# EAGLE design 16 ch sample-and-hold card v3 (EAGLE 9.6.2)
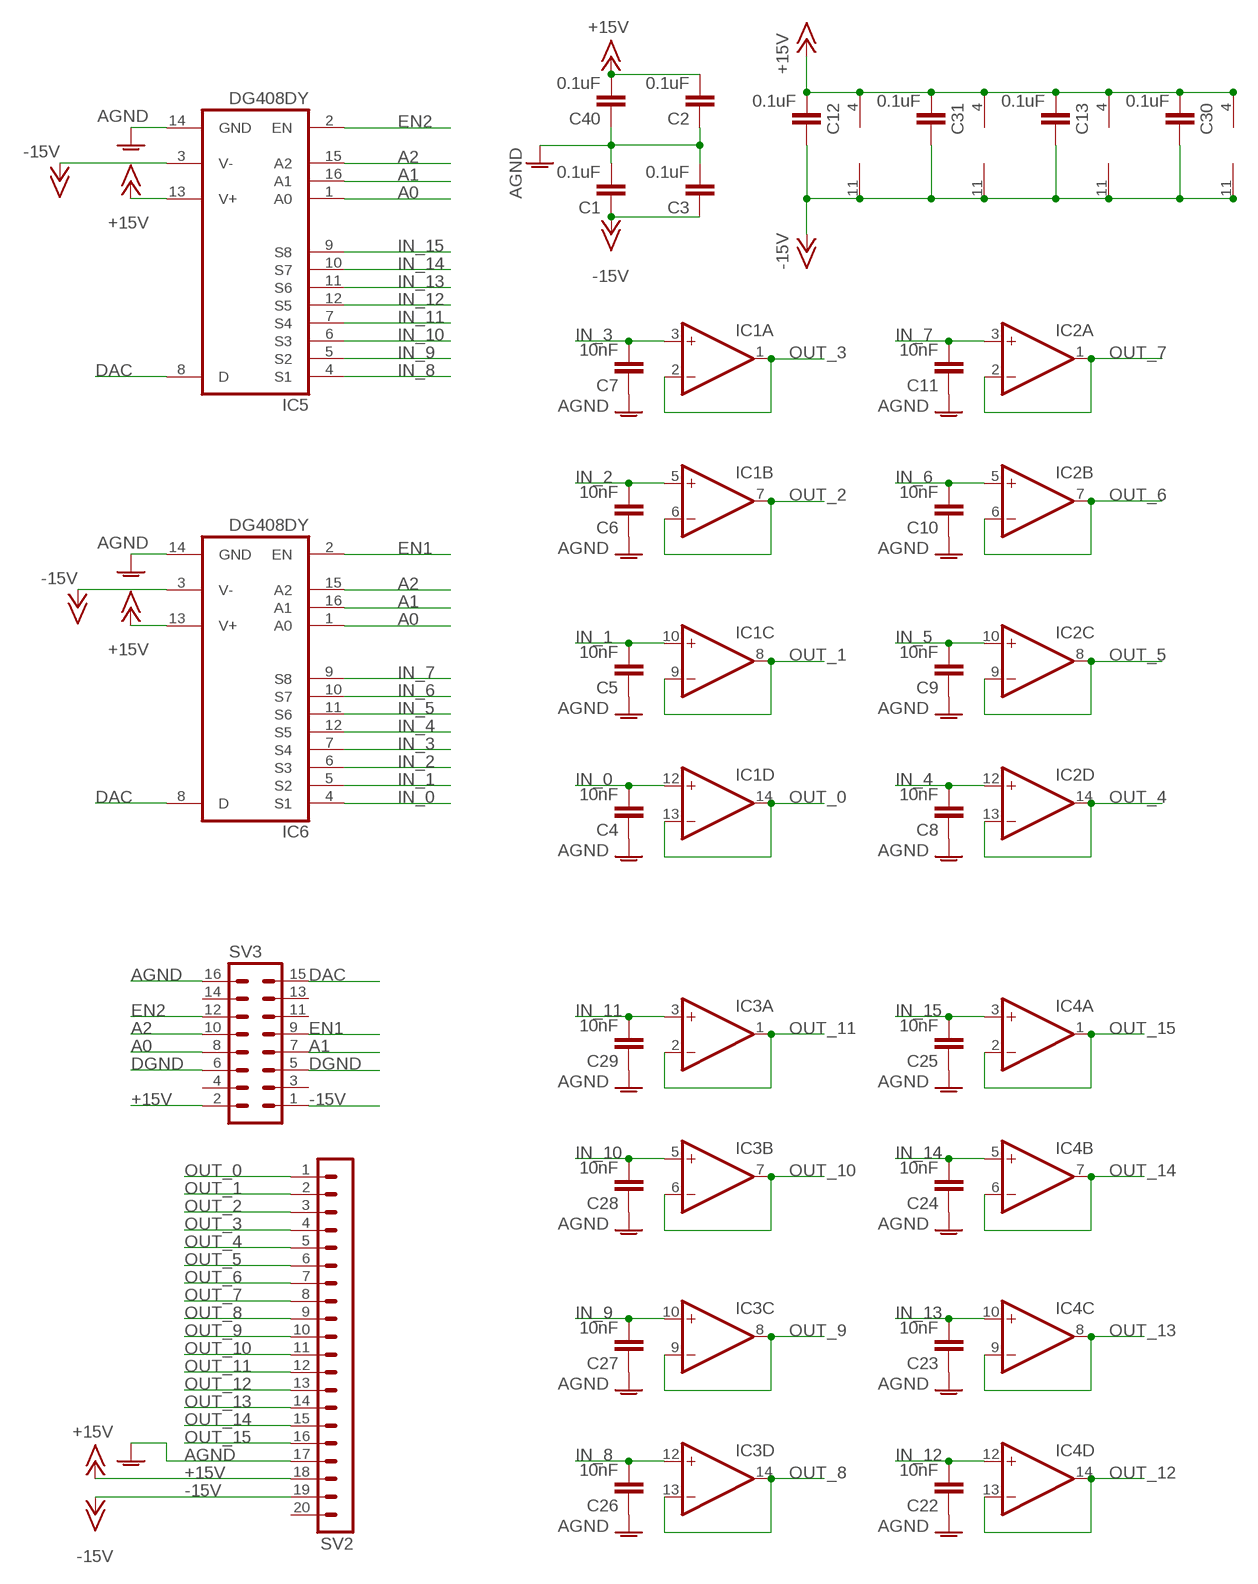
[diagram p0: schematic, sheet 1]

## Parts
C1  0.1uF  C-EUC0603  [C0603]
C2  0.1uF  C-EUC0603  [C0603]
C3  0.1uF  C-EUC0603  [C0603]
C4  10nF  C-EUC1206  [C1206]
C5  10nF  C-EUC1206  [C1206]
C6  10nF  C-EUC1206  [C1206]
C7  10nF  C-EUC1206  [C1206]
C8  10nF  C-EUC1206  [C1206]
C9  10nF  C-EUC1206  [C1206]
C10  10nF  C-EUC1206  [C1206]
C11  10nF  C-EUC1206  [C1206]
C12  0.1uF  C-EUC0603  [C0603]
C13  0.1uF  C-EUC0603  [C0603]
C22  10nF  C-EUC1206  [C1206]
C23  10nF  C-EUC1206  [C1206]
C24  10nF  C-EUC1206  [C1206]
C25  10nF  C-EUC1206  [C1206]
C26  10nF  C-EUC1206  [C1206]
C27  10nF  C-EUC1206  [C1206]
C28  10nF  C-EUC1206  [C1206]
C29  10nF  C-EUC1206  [C1206]
C30  0.1uF  C-EUC0603  [C0603]
C31  0.1uF  C-EUC0603  [C0603]
C40  0.1uF  C-EUC0603  [C0603]
IC1  TL074D  [SO14]
IC2  TL074D  [SO14]
IC3  TL074D  [SO14]
IC4  TL074D  [SO14]
IC5  DG408DY  [SO16]
IC6  DG408DY  [SO16]
SV2  MA20-1  [MA20-1]
SV3  MA08-2J  [MA08-2J]

## Nets
+15V: C2.2 C12.1 C13.1 C30.1 C31.1 C40.2 IC1.4(P:V+) IC2.4(P:V+) IC3.4(P:V+) IC4.4(P:V+) IC5.13(V+) IC6.13(V+) SV2.18 SV3.2
-15V: C1.1 C3.1 C12.2 C13.2 C30.2 C31.2 IC1.11(P:V-) IC2.11(P:V-) IC3.11(P:V-) IC4.11(P:V-) IC5.3(V-) IC6.3(V-) SV2.19 SV3.1
A0: IC5.1(A0) IC6.1(A0) SV3.8
A1: IC5.16(A1) IC6.16(A1) SV3.7
A2: IC5.15(A2) IC6.15(A2) SV3.10
AGND: C1.2 C2.1 C3.2 C4.1 C5.1 C6.1 C7.1 C8.1 C9.1 C10.1 C11.1 C22.1 C23.1 C24.1 C25.1 C26.1 C27.1 C28.1 C29.1 C40.1 IC5.14(GND) IC6.14(GND) SV2.17 SV3.16
DAC: IC5.8(D) IC6.8(D) SV3.15
DGND: SV3.5 SV3.6
EN1: IC6.2(EN) SV3.9
EN2: IC5.2(EN) SV3.12
IN_0: C4.2 IC1.12(D:+IN) IC6.4(S1)
IN_1: C5.2 IC1.10(C:+IN) IC6.5(S2)
IN_2: C6.2 IC1.5(B:+IN) IC6.6(S3)
IN_3: C7.2 IC1.3(A:+IN) IC6.7(S4)
IN_4: C8.2 IC2.12(D:+IN) IC6.12(S5)
IN_5: C9.2 IC2.10(C:+IN) IC6.11(S6)
IN_6: C10.2 IC2.5(B:+IN) IC6.10(S7)
IN_7: C11.2 IC2.3(A:+IN) IC6.9(S8)
IN_8: C26.2 IC3.12(D:+IN) IC5.4(S1)
IN_9: C27.2 IC3.10(C:+IN) IC5.5(S2)
IN_10: C28.2 IC3.5(B:+IN) IC5.6(S3)
IN_11: C29.2 IC3.3(A:+IN) IC5.7(S4)
IN_12: C22.2 IC4.12(D:+IN) IC5.12(S5)
IN_13: C23.2 IC4.10(C:+IN) IC5.11(S6)
IN_14: C24.2 IC4.5(B:+IN) IC5.10(S7)
IN_15: C25.2 IC4.3(A:+IN) IC5.9(S8)
OUT_0: IC1.13(D:-IN) IC1.14(D:OUT) SV2.1
OUT_1: IC1.8(C:OUT) IC1.9(C:-IN) SV2.2
OUT_2: IC1.6(B:-IN) IC1.7(B:OUT) SV2.3
OUT_3: IC1.1(A:OUT) IC1.2(A:-IN) SV2.4
OUT_4: IC2.13(D:-IN) IC2.14(D:OUT) SV2.5
OUT_5: IC2.8(C:OUT) IC2.9(C:-IN) SV2.6
OUT_6: IC2.6(B:-IN) IC2.7(B:OUT) SV2.7
OUT_7: IC2.1(A:OUT) IC2.2(A:-IN) SV2.8
OUT_8: IC3.13(D:-IN) IC3.14(D:OUT) SV2.9
OUT_9: IC3.8(C:OUT) IC3.9(C:-IN) SV2.10
OUT_10: IC3.6(B:-IN) IC3.7(B:OUT) SV2.11
OUT_11: IC3.1(A:OUT) IC3.2(A:-IN) SV2.12
OUT_12: IC4.13(D:-IN) IC4.14(D:OUT) SV2.13
OUT_13: IC4.8(C:OUT) IC4.9(C:-IN) SV2.14
OUT_14: IC4.6(B:-IN) IC4.7(B:OUT) SV2.15
OUT_15: IC4.1(A:OUT) IC4.2(A:-IN) SV2.16
Unconnected: SV2.20 SV3.3 SV3.4 SV3.11 SV3.13 SV3.14

## Library data of the parts
C1-C13 C22-C31 C40 = resistor:C-EU: CAPACITOR, European symbol
IC1-IC4 = linear:TL074: OP AMP
IC5 IC6 = maxim:DG408DY: ANALOG MULTIPLEXER; MPN: DG408DY+T; OC_FARNELL: 1077070; OC_NEWARK: 67K3719
SV2 = joakim:MA20-1: PIN HEADER; OC_FARNELL: unknown; OC_NEWARK: unknown
SV3 = joakim:MA08-2J: PIN HEADER; OC_FARNELL: unknown; OC_NEWARK: unknown

## Board
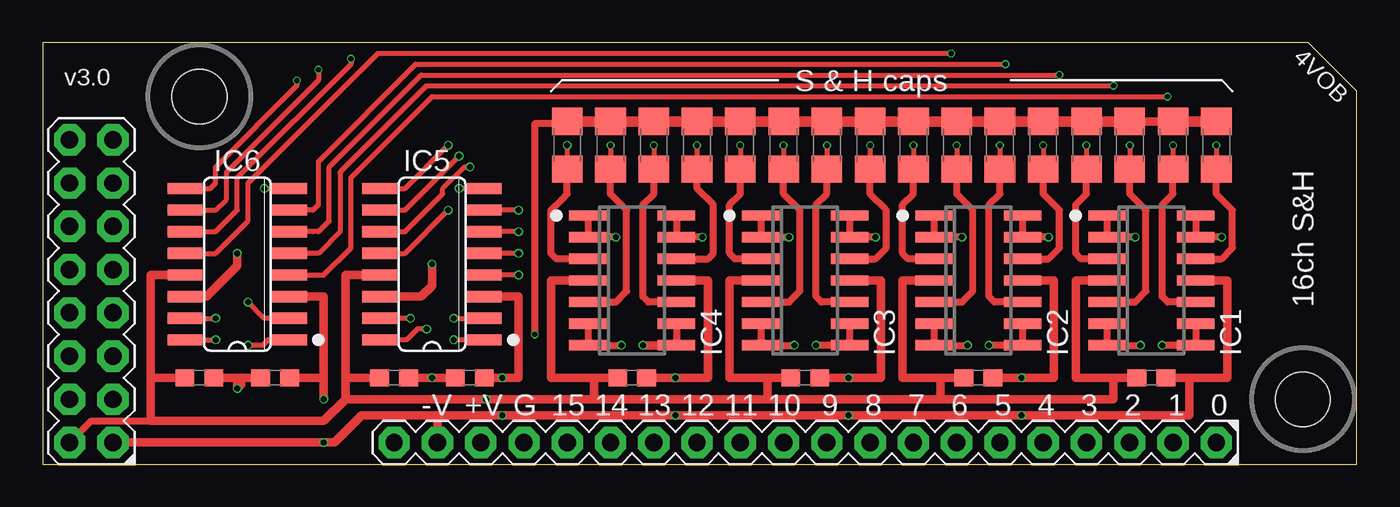
[diagram p1: board, top side]
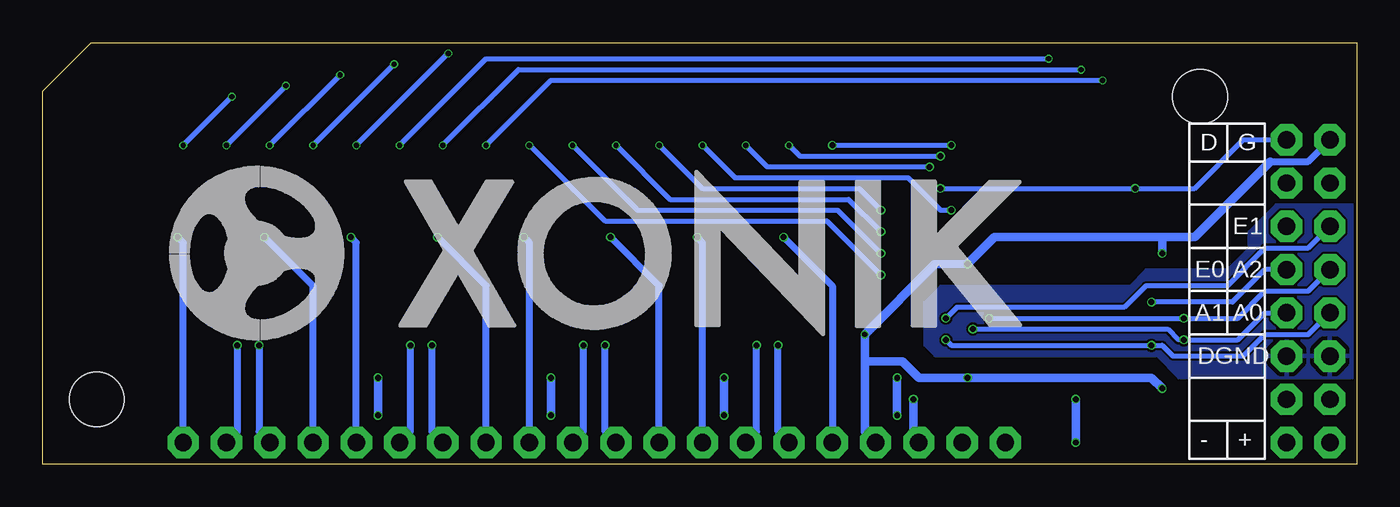
[diagram p2: board, bottom side, seen from below]

Size 77.15 x 24.77 mm. Coordinates in mm from the lower left corner, seen from the top.
Outline: 0,0 77.15,0 77.15,21.91 74.3,24.77 0,24.77 0,0
Copper layers (1*16): Top 0.035mm / dielectric 1.6mm / Bottom 0.035mm
Design rules "jlcpcb-2layers": minimum track width 5mil, minimum drill 0.3mm, track to track 5mil, track to pad 5mil, pad to pad 5mil, via to via 5mil, smd to smd 5mil, copper to edge 0.2mm, drill to drill 6mil, minimum pad ring 10mil, minimum via ring 3mil, stop-mask expansion 4mil, vias tented up to drill 0mil, thermal gap 10mil
Holes 3.2 mm at 9.21,21.59 73.98,3.81

### Footprints (pad centres in the part's own frame; a part is rotated, then mirrored left to right if it is on the bottom)
C0603 = smd 1.1 x 1: 1 -0.85,0; 2 0.85,0
C1206 = smd 1.6 x 1.8: 1 -1.4,0; 2 1.4,0
SO14 = smd 0.6 x 2.2: 1 -3.81,-2.6; 2 -2.54,-2.6; 3 -1.27,-2.6; 4 0,-2.6; 5 1.27,-2.6; 6 2.54,-2.6; 7 3.81,-2.6; 8 3.81,2.6; 9 2.54,2.6; 10 1.27,2.6; 11 0,2.6; 12 -1.27,2.6; 13 -2.54,2.6; 14 -3.81,2.6
SO16 = smd 0.66 x 2.032: 1 -4.445,-3.073; 2 -3.175,-3.073; 3 -1.905,-3.073; 4 -0.635,-3.073; 5 0.635,-3.073; 6 1.905,-3.073; 7 3.175,-3.073; 8 4.445,-3.073; 9 4.445,3.073; 10 3.175,3.073; 11 1.905,3.073; 12 0.635,3.073; 13 -0.635,3.073; 14 -1.905,3.073; 15 -3.175,3.073; 16 -4.445,3.073
MA20-1 = drill 1.016 octagon: 1 -24.13,0; 2 -21.59,0; 3 -19.05,0; 4 -16.51,0; 5 -13.97,0; 6 -11.43,0; 7 -8.89,0; 8 -6.35,0; 9 -3.81,0; 10 -1.27,0; 11 1.27,0; 12 3.81,0; 13 6.35,0; 14 8.89,0; 15 11.43,0; 16 13.97,0; 17 16.51,0; 18 19.05,0; 19 21.59,0; 20 24.13,0
MA08-2J = drill 1.016 octagon: 1 -8.89,-1.27; 2 -8.89,1.27; 3 -6.35,-1.27; 4 -6.35,1.27; 5 -3.81,-1.27; 6 -3.81,1.27; 7 -1.27,-1.27; 8 -1.27,1.27; 9 1.27,-1.27; 10 1.27,1.27; 11 3.81,-1.27; 12 3.81,1.27; 13 6.35,-1.27; 14 6.35,1.27; 15 8.89,-1.27; 16 8.89,1.27

### Placement (x,y rotation side)
C1  13.65,5.08 180 top
C2  20.64,5.08 180 top
C3  25.08,5.08 180 top
C4  68.9,18.73 270 top
C5  66.36,18.73 270 top
C6  63.82,18.73 270 top
C7  61.28,18.73 270 top
C8  58.74,18.73 270 top
C9  56.2,18.73 270 top
C10  53.66,18.73 270 top
C11  51.12,18.73 270 top
C12  65.09,5.08 0 top
C13  54.93,5.08 0 top
C22  38.42,18.73 270 top
C23  35.88,18.73 270 top
C24  33.34,18.73 270 top
C25  30.8,18.73 270 top
C26  48.58,18.73 270 top
C27  46.04,18.73 270 top
C28  43.5,18.73 270 top
C29  40.96,18.73 270 top
C30  34.61,5.08 0 top
C31  44.77,5.08 0 top
C40  9.21,5.08 180 top
IC1  65.09,10.79 270 top
IC2  54.93,10.79 270 top
IC3  44.77,10.79 270 top
IC4  34.61,10.79 270 top
IC5  22.86,11.75 90 top
IC6  11.43,11.75 90 top
SV2  44.77,1.27 180 top
SV3  2.86,10.16 90 top
U$1  [XONIK_LOGO_50]  69.69,7.3 0 bottom

### Tracks (layer width: path | path; a pad name or v marks a point on that pad's centre or on a via)
+15V  (via drill 0.35)
  Top 0.305: IC5.13 19.68,11.11
  Top 0.406: SV3.2 2.86,2.54 6.35,2.54
  Top 0.508: IC4.4 29.84,10.79 29.84,5.08 32.39,5.08 | 32.39,5.08 C30.1 | IC3.4 40.32,10.79 40.32,5.08 42.54,5.08 | 42.54,5.08 C31.1 | IC2.4 50.48,10.79 50.48,5.08 52.71,5.08 | 52.71,5.08 C13.1 | IC1.4 60.64,10.79 60.64,5.08 62.86,5.08 | 62.86,5.08 C12.1 | 32.39,5.08 32.39,3.81 | 42.54,5.08 42.54,3.81 | 42.54,3.81 32.39,3.81 | 42.54,3.81 52.71,3.81 | 52.71,3.81 52.71,5.08 | 52.71,3.81 62.86,3.81 62.86,5.08 | 32.39,3.81 v26.04,3.81 17.78,3.81 | C2.2 17.78,5.08 | 17.78,5.08 17.78,11.11 19.68,11.11 | 6.35,5.08 6.35,2.54 16.51,2.54 17.78,3.81 | 6.35,5.08 C40.2 | 17.78,5.08 17.78,3.81 | IC6.13 6.35,11.11 6.35,5.08
  Bottom 0.508: v26.04,3.81 26.04,1.59 SV2.18
-15V  (via drill 0.35)
  Top 0.508: IC4.11 39.05,10.79 39.05,5.08 v37.15,5.08 C30.2 | C31.2 v47.31,5.08 49.21,5.08 49.21,10.79 IC3.11 | C13.2 v57.47,5.08 59.37,5.08 59.37,10.79 IC2.11 | IC1.11 69.53,10.79 69.53,5.08 67.31,5.08 | C12.2 67.31,5.08 | 67.31,5.08 67.31,2.86 v57.47,2.86 v47.31,2.86 v37.15,2.86 v26.99,2.86 23.18,2.86 | IC5.3 27.94,9.84 27.94,5.08 v26.99,5.08 C3.1 | IC6.3 16.51,9.84 v16.51,3.81 16.51,4.98 16.41,5.08 C1.1 | SV2.19 23.18,2.86 | 23.18,2.86 18.73,2.86 17.15,1.27 v16.51,1.27 SV3.1
  Bottom 0.508: v57.47,5.08 v57.47,2.86 | v47.31,5.08 v47.31,2.86 | v37.15,5.08 v37.15,2.86 | v26.99,5.08 v26.99,2.86 | v16.51,3.81 v16.51,1.27
A0  (via drill 0.35)
  Top 0.305: IC5.1 v24.13,7.3 | IC6.1 13.23,7.3 12.92,6.99 v12.07,6.99
  Bottom 0.305: v24.13,7.3 23.81,6.99 v12.07,6.99 11.43,6.99 10.79,6.35 6.67,6.35 5.4,7.62 2.86,7.62 SV3.8
A1  (via drill 0.35)
  Top 0.305: IC6.16 v10.16,7.3 | v22.54,7.94 22.01,7.94 21.37,7.3 IC5.16
  Bottom 0.305: v22.54,7.94 11.11,7.94 10.48,7.3 v10.16,7.3 6.99,7.3 5.4,8.89 SV3.7
A2  (via drill 0.35)
  Top 0.305: IC6.15 v10.16,8.57 | v21.59,8.57 IC5.15
  Bottom 0.305: v21.59,8.57 v10.16,8.57 6.99,8.57 5.4,10.16 2.86,10.16 SV3.10
AGND  (via drill 0.3, 0.35)
  Top 0.406: C25.1 30.29,20.13 30.16,20 28.89,20 v28.89,7.62
  Top 0.508: IC5.14 22.22,9.84 22.86,10.48 v22.86,11.75 | IC6.14 9.63,9.84 11.43,11.65 v11.43,12.38 | C40.1 11.65,5.08 11.65,4.66 v11.43,4.45 11.43,4.98 11.53,5.08 C1.2 | C2.1 v22.86,5.08 C3.2 | C6.1 C5.1
  Top 0.61: C4.1 C5.1 | C6.1 C7.1 C8.1 C9.1 C10.1 C11.1 C26.1 C27.1 C28.1 C29.1 C22.1 C23.1 C24.1 C25.1
  Bottom 0.406: 5.08,17.78 2.86,17.78 SV3.16
  Bottom 0.508: 28.89,6.03 26.67,6.03 25.72,5.08 v22.86,5.08 12.07,5.08 v11.43,4.45 | 11.43,13.34 21.27,13.34 v22.86,11.75 24.77,11.75 v28.89,7.62 28.89,6.03 | 11.43,13.34 9.52,13.34 5.08,17.78 | v11.43,12.38 11.43,13.34 | SV2.17 28.89,1.91 28.89,6.03
DAC  (via drill 0.35)
  Top 0.305: IC5.8 v24.45,16.19 | v13.02,16.19 IC6.8
  Bottom 0.305: v24.45,16.19 v13.02,16.19 9.52,16.19 6.67,19.05 SV3.15
DGND
  pour Bottom: 0,5.08 10.48,5.08 11.75,6.35 24.77,6.35 25.4,6.99 25.4,9.53 24.45,10.48 13.34,10.48 12.38,11.43 7.62,11.43 6.35,12.7 6.35,13.65 4.76,15.24 0,15.24
EN1  (via drill 0.35)
  Top 0.305: IC6.2 13.02,8.57 v12.07,9.53
  Bottom 0.305: SV3.9 5.4,11.43 7.3,9.53 v12.07,9.53
EN2  (via drill 0.35)
  Top 0.305: v24.13,8.57 IC5.2
  Bottom 0.305: v24.13,8.57 23.49,9.21 13.65,9.21 12.38,10.48 7.62,10.48 5.4,12.7 2.86,12.7 SV3.12
IN_0  (via drill 0.3)
  Top 0.305: v68.9,18.73 C4.2 | IC6.4 16.51,11.11 18.1,12.7 18.1,16.83 22.86,21.59 v66.04,21.59
  Top 0.406: IC1.12 69.21,12.06 69.85,12.7 69.85,14.92 68.9,15.88 C4.2
  Bottom 0.305: v66.04,21.59 v68.9,18.73
IN_1  (via drill 0.3)
  Top 0.305: v66.36,18.73 C5.2 | IC6.5 16.19,12.38 17.46,13.65 17.46,17.14 22.54,22.23 v62.86,22.23
  Top 0.406: IC1.10 66.04,9.53 65.72,9.84 65.72,15.24 66.36,15.88 C5.2
  Bottom 0.305: v62.86,22.23 v66.36,18.73
IN_2  (via drill 0.3)
  Top 0.305: v63.82,18.73 C6.2 | v59.69,22.86 22.22,22.86 16.83,17.46 16.83,14.29 16.19,13.65 15.87,13.65 15.24,13.65 IC6.6
  Top 0.406: IC1.5 64.14,9.53 64.77,10.16 64.77,14.92 63.82,15.88 C6.2
  Bottom 0.305: v59.69,22.86 v63.82,18.73
IN_3  (via drill 0.3)
  Top 0.305: v61.28,18.73 C7.2 | IC6.7 15.87,14.92 16.19,15.24 16.19,17.78 21.91,23.5 v56.51,23.5
  Top 0.406: IC1.3 60.96,12.06 60.64,12.38 60.64,15.24 61.28,15.88 C7.2
  Bottom 0.305: v56.51,23.5 v61.28,18.73
IN_4  (via drill 0.3)
  Top 0.305: v58.74,18.73 C8.2 | IC6.12 10.16,12.38 12.07,14.29 12.07,16.51 19.68,24.13 v53.34,24.13
  Top 0.406: IC2.12 59.05,12.06 59.69,12.7 59.69,14.92 58.74,15.88 C8.2
  Bottom 0.305: v53.34,24.13 v58.74,18.73
IN_5  (via drill 0.3)
  Top 0.305: v56.2,18.73 C9.2 | IC6.11 10.16,13.65 11.43,14.92 11.43,16.83 18.1,23.5 v18.1,23.81
  Top 0.406: IC2.10 55.88,9.53 55.56,9.84 55.56,15.24 56.2,15.88 C9.2
  Bottom 0.305: v18.1,23.81 51.12,23.81 v56.2,18.73
IN_6  (via drill 0.3)
  Top 0.305: v53.66,18.73 C10.2 | v16.19,23.18 16.19,22.54 10.79,17.14 10.79,15.56 10.16,14.92 IC6.10
  Top 0.406: IC2.5 53.97,9.53 54.61,10.16 54.61,14.92 53.66,15.88 C10.2
  Bottom 0.305: v16.19,23.18 49.21,23.18 v53.66,18.73
IN_7  (via drill 0.3)
  Top 0.305: v51.12,18.73 C11.2 | IC6.9 9.84,16.19 10.16,16.51 10.16,17.46 14.92,22.23 v14.92,22.54
  Top 0.406: IC2.3 50.8,12.06 50.48,12.38 50.48,15.24 51.12,15.88 C11.2
  Bottom 0.305: v51.12,18.73 47.31,22.54 v14.92,22.54
IN_8  (via drill 0.3, 0.35)
  Top 0.305: v27.94,11.11 IC5.4 | v48.58,18.73 C26.2
  Top 0.406: IC3.12 48.9,12.06 49.53,12.7 49.53,14.92 48.58,15.88 C26.2
  Bottom 0.305: v48.58,18.73 44.13,14.29 31.11,14.29 v27.94,11.11
IN_9  (via drill 0.3, 0.35)
  Top 0.305: v27.94,12.38 IC5.5 | v46.04,18.73 C27.2
  Top 0.406: IC3.10 45.72,9.53 45.4,9.84 45.4,15.24 46.04,15.88 C27.2
  Bottom 0.305: v46.04,18.73 42.23,14.92 30.48,14.92 v27.94,12.38
IN_10  (via drill 0.3, 0.35)
  Top 0.305: v27.94,13.65 IC5.6 | v43.5,18.73 C28.2
  Top 0.406: IC3.5 43.82,9.53 44.45,10.16 44.45,14.92 43.5,15.88 C28.2
  Bottom 0.305: v43.5,18.73 40.32,15.56 29.84,15.56 v27.94,13.65
IN_11  (via drill 0.3, 0.35)
  Top 0.254: C29.2 40.96,17.46
  Top 0.305: v27.94,14.92 IC5.7 | v40.96,18.73 40.96,17.14
  Top 0.406: IC3.3 40.64,12.06 40.32,12.38 40.32,15.24 40.96,15.88 40.96,17.14 40.96,17.46
  Bottom 0.305: v40.96,18.73 38.42,16.19 29.21,16.19 v27.94,14.92
IN_12  (via drill 0.3, 0.35)
  Top 0.254: C22.2 38.42,17.46
  Top 0.305: v38.42,18.73 38.42,17.46 | IC5.12 21.27,12.38 v23.81,14.92
  Top 0.406: IC4.12 39.05,12.06 39.37,12.38 39.37,15.24 38.42,16.19 38.42,17.46
  Bottom 0.305: v38.42,18.73 36.51,16.83 26.35,16.83 24.45,14.92 v23.81,14.92
IN_13  (via drill 0.3, 0.35)
  Top 0.305: v35.88,18.73 35.88,17.14 | IC5.11 21.27,13.65 23.49,15.88 23.49,16.19 24.77,17.46 v25.08,17.46
  Top 0.406: IC4.10 35.56,9.53 35.24,9.84 35.24,15.24 35.88,15.88 35.88,17.14 C23.2
  Bottom 0.305: v35.88,18.73 34.61,17.46 v25.08,17.46
IN_14  (via drill 0.3, 0.35)
  Top 0.254: C24.2 33.34,17.46
  Top 0.305: v33.34,18.73 33.34,17.46 | IC5.10 21.27,14.92 v24.45,18.1
  Top 0.406: IC4.5 33.65,9.53 34.29,10.16 34.29,14.92 33.34,15.88 33.34,17.46
  Bottom 0.305: v33.34,18.73 32.7,18.1 v24.45,18.1
IN_15  (via drill 0.35)
  Top 0.305: IC5.9 21.27,16.19 v23.81,18.73 | v30.8,18.73 C25.2
  Top 0.406: IC4.3 30.16,12.06 29.84,12.38 29.84,14.92 30.48,15.56 30.8,15.88 C25.2
  Bottom 0.305: v30.8,18.73 v23.81,18.73
OUT_0  (via drill 0.35)
  Top 0.406: IC1.14 IC1.13 v69.21,13.34
  Bottom 0.406: SV2.1 68.9,13.02 v69.21,13.34
OUT_1  (via drill 0.35)
  Top 0.406: IC1.9 IC1.8 v65.72,6.99
  Bottom 0.406: v65.72,6.99 65.72,1.91 SV2.2
OUT_2  (via drill 0.35)
  Top 0.406: IC1.6 IC1.7 v64.45,6.99
  Bottom 0.406: v64.45,6.99 64.45,1.91 SV2.3
OUT_3  (via drill 0.35)
  Top 0.406: IC1.2 IC1.1 62.49,13.39 62.55,13.34 v64.14,13.34
  Bottom 0.406: SV2.4 61.28,10.48 v64.14,13.34
OUT_4  (via drill 0.35)
  Top 0.406: v59.05,13.34 IC2.13 IC2.14
  Bottom 0.406: SV2.5 58.74,13.02 v59.05,13.34
OUT_5  (via drill 0.35)
  Top 0.406: IC2.9 IC2.8 v55.56,6.99
  Bottom 0.406: SV2.6 55.56,1.91 v55.56,6.99
OUT_6  (via drill 0.35)
  Top 0.406: IC2.6 IC2.7 v54.29,6.99
  Bottom 0.406: SV2.7 54.29,1.91 v54.29,6.99
OUT_7  (via drill 0.35)
  Top 0.406: IC2.1 IC2.2 v53.97,13.34
  Bottom 0.406: SV2.8 51.12,10.48 v53.97,13.34
OUT_8  (via drill 0.35)
  Top 0.406: IC3.14 IC3.13 v48.9,13.34
  Bottom 0.406: SV2.9 48.58,13.02 v48.9,13.34
OUT_9  (via drill 0.35)
  Top 0.406: IC3.9 IC3.8 v45.4,6.99
  Bottom 0.406: SV2.10 45.4,1.91 v45.4,6.99
OUT_10  (via drill 0.35)
  Top 0.406: IC3.6 IC3.7 v44.13,6.99
  Bottom 0.406: SV2.11 44.13,1.91 v44.13,6.99
OUT_11  (via drill 0.35)
  Top 0.406: IC3.1 IC3.2 v43.82,13.34
  Bottom 0.406: SV2.12 40.96,10.48 v43.82,13.34
OUT_12  (via drill 0.35)
  Top 0.406: IC4.14 IC4.13 v38.73,13.34
  Bottom 0.406: SV2.13 38.42,13.02 v38.73,13.34
OUT_13  (via drill 0.35)
  Top 0.406: IC4.9 IC4.8
  Top 0.508: v35.24,6.99 IC4.8
  Bottom 0.406: SV2.14 35.24,1.91 v35.24,6.99
OUT_14  (via drill 0.35)
  Top 0.406: IC4.6 IC4.7 v33.97,6.99
  Bottom 0.406: SV2.15 33.97,1.91 v33.97,6.99
OUT_15  (via drill 0.35)
  Top 0.406: IC4.1 IC4.2 v33.65,13.34
  Bottom 0.406: v33.65,13.34 30.8,10.48 SV2.16

### Text on the board
tNames: 4VOB | v3.0 | S & H caps | 16ch S&H | -V | +V | G | 15 | 14 | 13 | 12 | 11 | 10 | 9 | 8 | 7 | 6 | 5 | 4 | 3 | 2 | 1 | 0
bNames: G | D | E1 | A2 | E0 | A0 | A1 | DGND | + | -